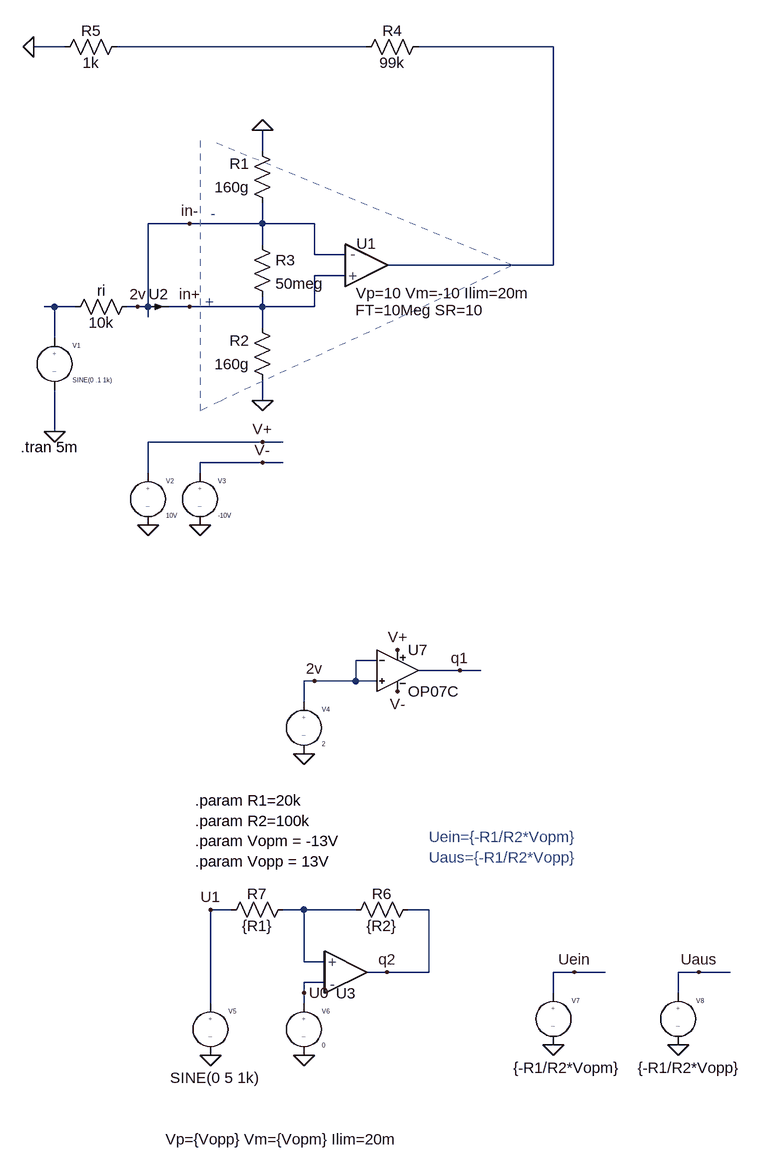
[diagram p0: schematic OP_eingangswiderstand.asc]
OP_eingangswiderstand.asc, the LTspice schematic file:
Version 4
SHEET 1 948 1620
WIRE -128 -80 -176 -80
WIRE 336 -80 -48 -80
WIRE 624 -80 416 -80
WIRE 176 80 176 48
WIRE 64 192 0 192
WIRE 176 192 176 160
WIRE 176 192 64 192
WIRE 256 192 176 192
WIRE 176 224 176 192
WIRE 256 240 256 192
WIRE 304 240 256 240
WIRE 624 256 624 -80
WIRE 624 256 368 256
WIRE 304 272 256 272
WIRE -144 320 -160 320
WIRE -112 320 -144 320
WIRE -16 320 -32 320
WIRE 0 320 0 192
WIRE 0 320 -16 320
WIRE 64 320 32 320
WIRE 176 320 176 304
WIRE 176 320 64 320
WIRE 256 320 256 272
WIRE 256 320 176 320
WIRE 0 336 0 320
WIRE 176 352 176 320
WIRE -144 368 -144 320
WIRE 176 464 176 432
WIRE -144 512 -144 448
WIRE 176 528 0 528
WIRE 208 528 176 528
WIRE 176 560 80 560
WIRE 208 560 176 560
WIRE 0 576 0 528
WIRE 80 576 80 560
WIRE 352 864 320 864
WIRE 480 880 416 880
WIRE 512 880 480 880
WIRE 256 896 240 896
WIRE 320 896 320 864
WIRE 320 896 256 896
WIRE 352 896 320 896
WIRE 240 928 240 896
WIRE 128 1248 96 1248
WIRE 240 1248 208 1248
WIRE 320 1248 240 1248
WIRE 432 1248 400 1248
WIRE 240 1328 240 1248
WIRE 272 1328 240 1328
WIRE 368 1344 336 1344
WIRE 432 1344 432 1248
WIRE 432 1344 368 1344
WIRE 656 1344 624 1344
WIRE 704 1344 656 1344
WIRE 848 1344 816 1344
WIRE 896 1344 848 1344
WIRE 272 1360 240 1360
WIRE 240 1376 240 1360
WIRE 624 1376 624 1344
WIRE 816 1376 816 1344
WIRE 96 1392 96 1248
WIRE 240 1392 240 1376
FLAG 176 464 0
FLAG 176 48 0
FLAG -176 -80 0
FLAG -144 512 0
FLAG 64 320 in+
FLAG 64 192 in-
FLAG 0 656 0
FLAG 80 656 0
FLAG 176 528 V+
FLAG 176 560 V-
FLAG 384 912 V-
FLAG 384 848 V+
FLAG 480 880 q1
FLAG 240 1008 0
FLAG 368 1344 q2
FLAG 256 896 2v
FLAG -16 320 2v
FLAG 96 1472 0
FLAG 240 1472 0
FLAG 240 1376 U0
FLAG 96 1248 U1
FLAG 624 1456 0
FLAG 816 1456 0
FLAG 656 1344 Uein
FLAG 848 1344 Uaus
SYMBOL res 192 176 R180
WINDOW 0 36 76 Left 2
WINDOW 3 36 40 Left 2
SYMATTR InstName R1
SYMATTR Value 160g
SYMBOL res 160 208 R0
SYMATTR InstName R3
SYMATTR Value 50meg
SYMBOL EIT_Semiconductors\\op_3 336 256 R0
SYMATTR InstName U1
SYMBOL res 432 -96 R90
WINDOW 0 7 56 VBottom 2
WINDOW 3 25 56 VTop 2
SYMATTR InstName R4
SYMATTR Value 99k
SYMBOL res -32 -96 R90
WINDOW 0 7 56 VBottom 2
WINDOW 3 25 56 VTop 2
SYMATTR InstName R5
SYMATTR Value 1k
SYMBOL source-V -144 352 R0
WINDOW 123 0 0 Left 2
WINDOW 39 0 0 Left 2
SYMATTR InstName V1
SYMATTR Value SINE(0 .1 1k)
SYMBOL res -128 336 R270
WINDOW 0 25 56 VTop 2
WINDOW 3 7 56 VBottom 2
SYMATTR InstName ri
SYMATTR Value 10k
SYMBOL MDB_sym\\arrow_curr 16 320 R270
WINDOW 0 4 0 VTop 2
SYMATTR InstName U2
SYMBOL source-V 0 560 R0
WINDOW 123 0 0 Left 2
WINDOW 39 0 0 Left 2
SYMATTR InstName V2
SYMATTR Value 10V
SYMBOL source-V 80 560 R0
WINDOW 123 0 0 Left 2
WINDOW 39 0 0 Left 2
SYMATTR InstName V3
SYMATTR Value -10V
SYMBOL MDB_sym\\OP07 384 816 R0
SYMATTR InstName U7
SYMBOL source-V 240 912 R0
WINDOW 123 0 0 Left 2
WINDOW 39 0 0 Left 2
SYMATTR InstName V4
SYMATTR Value 2
SYMBOL EIT_Semiconductors\\op_3 304 1344 M180
WINDOW 123 -17 69 Invisible 2
WINDOW 3 -277 -257 Left 2
SYMATTR InstName U3
SYMATTR Value Vp={Vopp} Vm={Vopm} Ilim=20m
SYMBOL res 192 448 R180
WINDOW 0 36 76 Left 2
WINDOW 3 36 40 Left 2
SYMATTR InstName R2
SYMATTR Value 160g
SYMBOL res 416 1232 R90
WINDOW 0 7 56 VBottom 2
WINDOW 3 25 56 VTop 2
SYMATTR InstName R6
SYMATTR Value {R2}
SYMBOL res 224 1232 R90
WINDOW 0 7 56 VBottom 2
WINDOW 3 25 56 VTop 2
SYMATTR InstName R7
SYMATTR Value {R1}
SYMBOL source-V 96 1376 R0
WINDOW 3 -62 131 Left 2
WINDOW 123 0 0 Left 2
WINDOW 39 0 0 Left 2
SYMATTR InstName V5
SYMATTR Value SINE(0 5 1k)
SYMBOL source-V 240 1376 R0
WINDOW 123 0 0 Left 2
WINDOW 39 0 0 Left 2
SYMATTR InstName V6
SYMATTR Value 0
SYMBOL source-V 624 1360 R0
WINDOW 3 -62 131 Left 2
WINDOW 123 0 0 Left 2
WINDOW 39 0 0 Left 2
SYMATTR InstName V7
SYMATTR Value {-R1/R2*Vopm}
SYMBOL source-V 816 1360 R0
WINDOW 3 -62 131 Left 2
WINDOW 123 0 0 Left 2
WINDOW 39 0 0 Left 2
SYMATTR InstName V8
SYMATTR Value {-R1/R2*Vopp}
TEXT 96 176 Left 2 ;-
TEXT 88 312 Left 2 ;+
TEXT -196 536 Left 2 !.tran 5m
TEXT 72 1080 Left 2 !.param R1=20k\n.param R2=100k\n.param Vopm = -13V\n.param Vopp = 13V
TEXT 432 1136 Left 2 ;Uein={-R1/R2*Vopm}\nUaus={-R1/R2*Vopp}
LINE Normal 560 256 96 64 2
LINE Normal 112 464 560 256 2
LINE Normal 80 480 112 464 2
LINE Normal 80 64 80 480 2

The netlist it stands for:
* OP_eingangswiderstand.asc
R1 2v 0 160g
R3 2v in+ 50meg
XU1 in+ 2v N002 opamp_param_3 Vp=10 Vm=-10 Ilim=20m FT=10Meg SR=10 Vos=0 A0=100k phir=45 en=0 enk=0 in=0 ink=0 Rin=500Meg  ; pins In+ In- OUT
R4 N002 N001 99k
R5 N001 0 1k
V1 N003 0 SINE(0 .1 1k)
ri N003 2v 10k
R§U2 2v in+ 100e-6
V2 V+ 0 10V
V3 V- 0 -10V
XU7 2v 2v V+ V- q1 OP07C OP07C  ; pins In+ In- V+ V- OUT
V4 2v 0 2
XU3 N004 U0 q2 opamp_param_3 Vp={Vopp} Vm={Vopm} Ilim=20m FT=10Meg SR=10 Vos=0 A0=100k phir=45 en=0 enk=0 in=0 ink=0 Rin=500Meg  ; pins In+ In- OUT
R2 0 in+ 160g
R6 q2 N004 {R2}
R7 N004 U1 {R1}
V5 U1 0 SINE(0 5 1k)
V6 U0 0 0
V7 Uein 0 {-R1/R2*Vopm}
V8 Uaus 0 {-R1/R2*Vopp}
* -
* +
.tran 5m
.param R1=20k
.param R2=100k
.param Vopm = -13V
.param Vopp = 13V
* Uein={-R1/R2*Vopm}
* Uaus={-R1/R2*Vopp}
.lib EIT_sub\opamp_parametrierbar.sub
.lib MDB_sub/Op07c.sub
.backanno
.end